# Altium project pm.PrjPcb
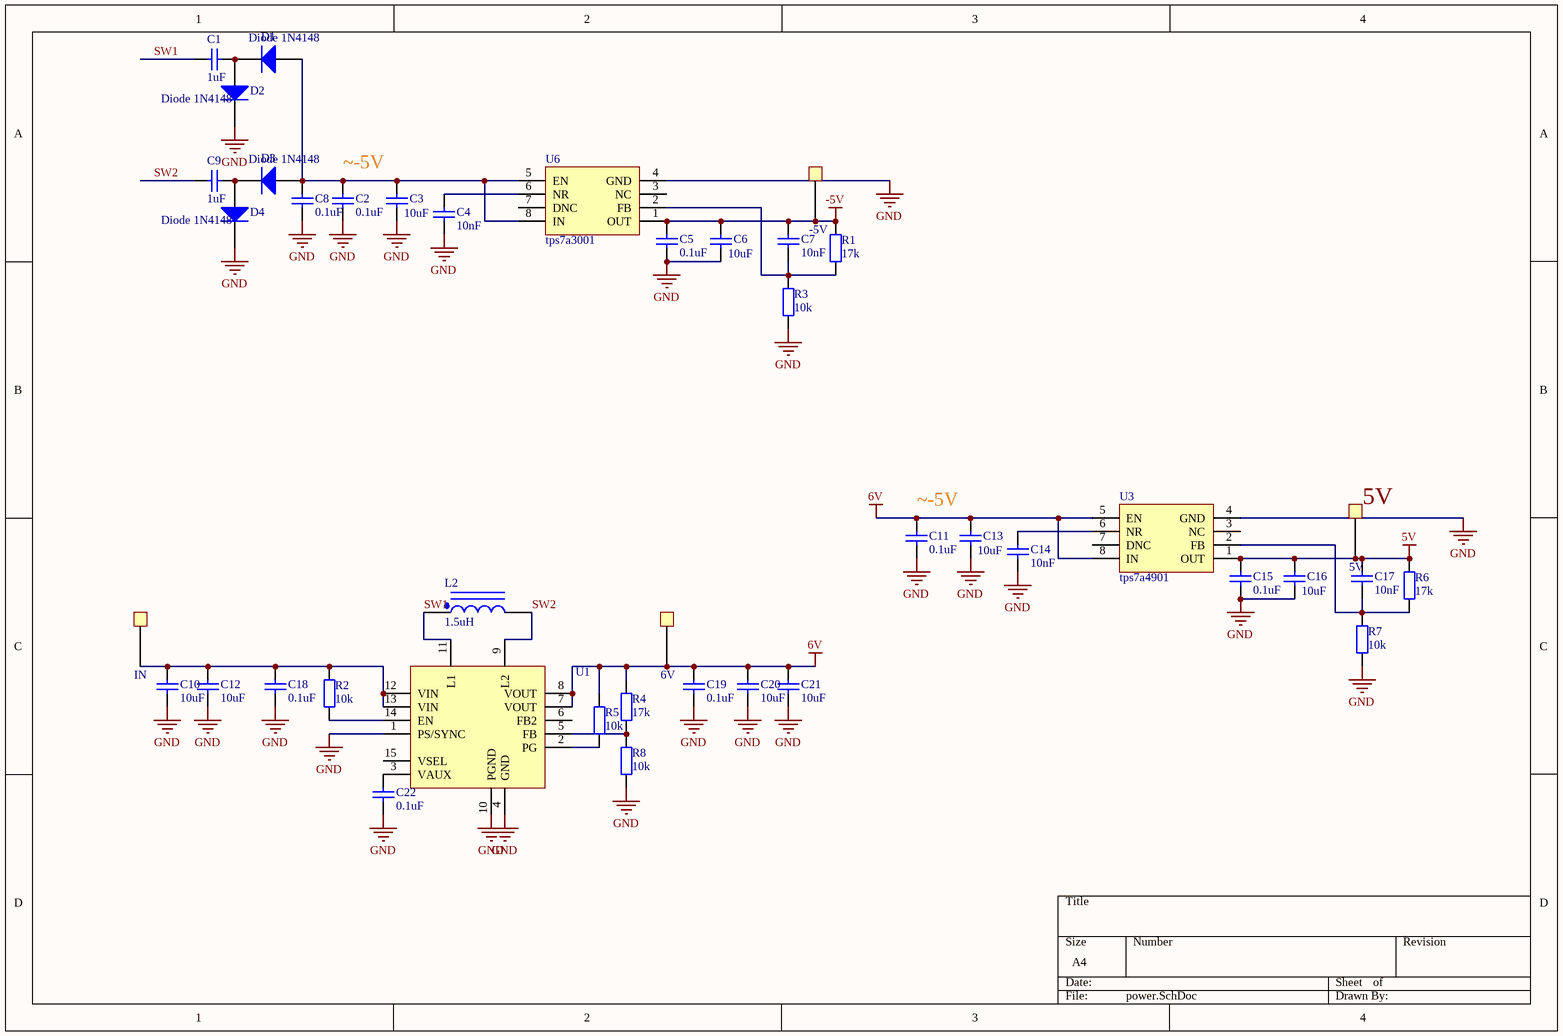
[diagram p0: power.SchDoc]
1 sheet, 42 parts. Net scope: global (net labels, ports and power ports of the same name join across sheets).
Board file: pm.PcbDoc

## Sheet power.SchDoc
size A4

### Parts
5V  TestPad  [TestPad]  (value not drawn)
6V  TestPad  [TestPad]  (value not drawn)
-5V  TestPad  [TestPad]  (value not drawn)
C1  1uF  [0603L]
C2  0.1uF  [0603L]
C3  10uF  [0805]
C4  10nF  [0402]
C5  0.1uF  [0603L]
C6  10uF  [0805]
C7  10nF  [0402]
C8  0.1uF  [0603L]
C9  1uF  [0603L]
C10  10uF  [0805]
C11  0.1uF  [0603L]
C12  10uF  [0805]
C13  10uF  [0805]
C14  10nF  [0402]
C15  0.1uF  [0603L]
C16  10uF  [0805]
C17  10nF  [0402]
C18  0.1uF  [0603L]
C19  0.1uF  [0603L]
C20  10uF  [0805]
C21  10uF  [0805]
C22  0.1uF  [0402]
D1  Diode 1N4148  [LC-SOD-323]
D2  Diode 1N4148  [LC-SOD-323]
D3  Diode 1N4148  [LC-SOD-323]
D4  Diode 1N4148  [LC-SOD-323]
IN  TestPad  [TestPad]  (value not drawn)
L2  1.5uH  [L4015]
R1  17k  [0402]
R2  10k  [0402]
R3  10k  [0402]
R4  17k  [0402]
R5  10k  [0402]
R6  17k  [0402]
R7  10k  [0402]
R8  10k  [0402]
U1  tps63070  [TPS63070]  (value not drawn)
U3  tps7a4901  [MSOP8/VSSOP8]
U6  tps7a3001  [MSOP8/VSSOP8]

### Nets
5V: 5V.1 C15.1 C16.2 C17.1 R6.2 U3.1(OUT)
6V: 6V.1 C11.1 C13.2 C19.2 C20.2 C21.2 R4.2 R5.2 U1.7(VOUT) U1.8(VOUT) U3.5(EN) U3.8(IN)
-5V: -5V.1 C5.1 C6.2 C7.1 R1.2 U6.1(OUT)
GND: C2.2 C3.1 C4.2 C5.2 C6.1 C8.2 C10.1 C11.2 C12.1 C13.1 C14.2 C15.2 C16.1 C18.1 C19.1 C20.1 C21.1 C22.2 D2.2(K) D4.2(K) R3.1 R7.1 R8.1 U1.1(PS/SYNC) U1.4(GND) U1.10(PGND) U3.4(GND) U6.4(GND)
SW1: C1.2 L2.1 U1.11(L1)
SW2: C9.2 L2.2 U1.9(L2)
NetC1_1: C1.1 D1.2(K) D2.1(A)
NetC2_1: C2.1 C3.2 C8.1 D1.1(A) D3.1(A) U6.5(EN) U6.8(IN)
NetC4_1: C4.1 U6.6(NR)
NetC7_2: C7.2 R1.1 R3.2 U6.2(FB)
NetC9_1: C9.1 D3.2(K) D4.1(A)
NetC10_2: C10.2 C12.2 C18.2 IN.1 R2.2 U1.12(VIN) U1.13(VIN)
NetC14_1: C14.1 U3.6(NR)
NetC17_2: C17.2 R6.1 R7.2 U3.2(FB)
NetC22_1: C22.1 U1.3(VAUX)
NetR2_1: R2.1 U1.14(EN)
NetR4_1: R4.1 R8.2 U1.5(FB)
NetR5_1: R5.1 U1.2(PG)

Not connected (* = marked no-connect by the designer): U1 6(FB2) 15(VSEL); U3 3(NC) 7(DNC); U6 3(NC) 7(DNC)

### Notes on the sheet
- ~-5V
- (near 5V) 5V

### Library data of the parts
C1-C22 = Cap: Capacitor; Published: 8-Jun-2000; LatestRevisionDate: 17-Jul-2002; LatestRevisionNote: Re-released for DXP Platform.; PackageReference: RAD-0.3; Publisher: Altium Limited; PackageDescription: Radial Cap, Thru-Hole; 2 Leads; 0.3 in Pin Spacing
D1-D4 = Diode 1N4148: High Conductance Fast Diode; Published: 8-Jun-2000; LatestRevisionDate: 17-Jul-2002; LatestRevisionNote: Re-released for DXP Platform.; DatasheetVersion: 1997; PackageReference: DO-35; Publisher: Altium Limited; PackageDescription: Diode, Axial; Body 3.8 x 1.9 mm (LxDia. max), Lead Dia. 0.53 mm (max); Code_JEDEC: DO-204-AH; ComponentLink1Description: Manufacturer Link; ComponentLink1URL: http://www.fairchildsemi.com/; ComponentLink2Description: Datasheet; ComponentLink2URL: http://www.fairchildsemi.com/ds/1N%2F1N4148.pdf
L2 = Inductor Iron Dot: Magnetic-Core Inductor with Winding Polarity Marking; Published: 24-Mar-1999; LatestRevisionDate: 17-Jul-2002; LatestRevisionNote: Re-released for DXP Platform.; PackageReference: DIODE_SMC; Publisher: Altium Limited; PackageDescription: Diode; 2 Leads
R1-R8 = Res2: Resistor; Published: 8-Jun-2000; LatestRevisionDate: 17-Jul-2002; LatestRevisionNote: Re-released for DXP Platform.; PackageReference: AXIAL-0.4; Publisher: Altium Limited; PackageDescription: Axial Device, Thru-Hole; 2 Leads; 0.4 in Pin Spacing
U3 = tps7a3001